# Altium schematic sheet 06_SAMA7G54-MPU.SchDoc
size 420 x 297 mm; SheetNumber: 27; SheetTotal: 29
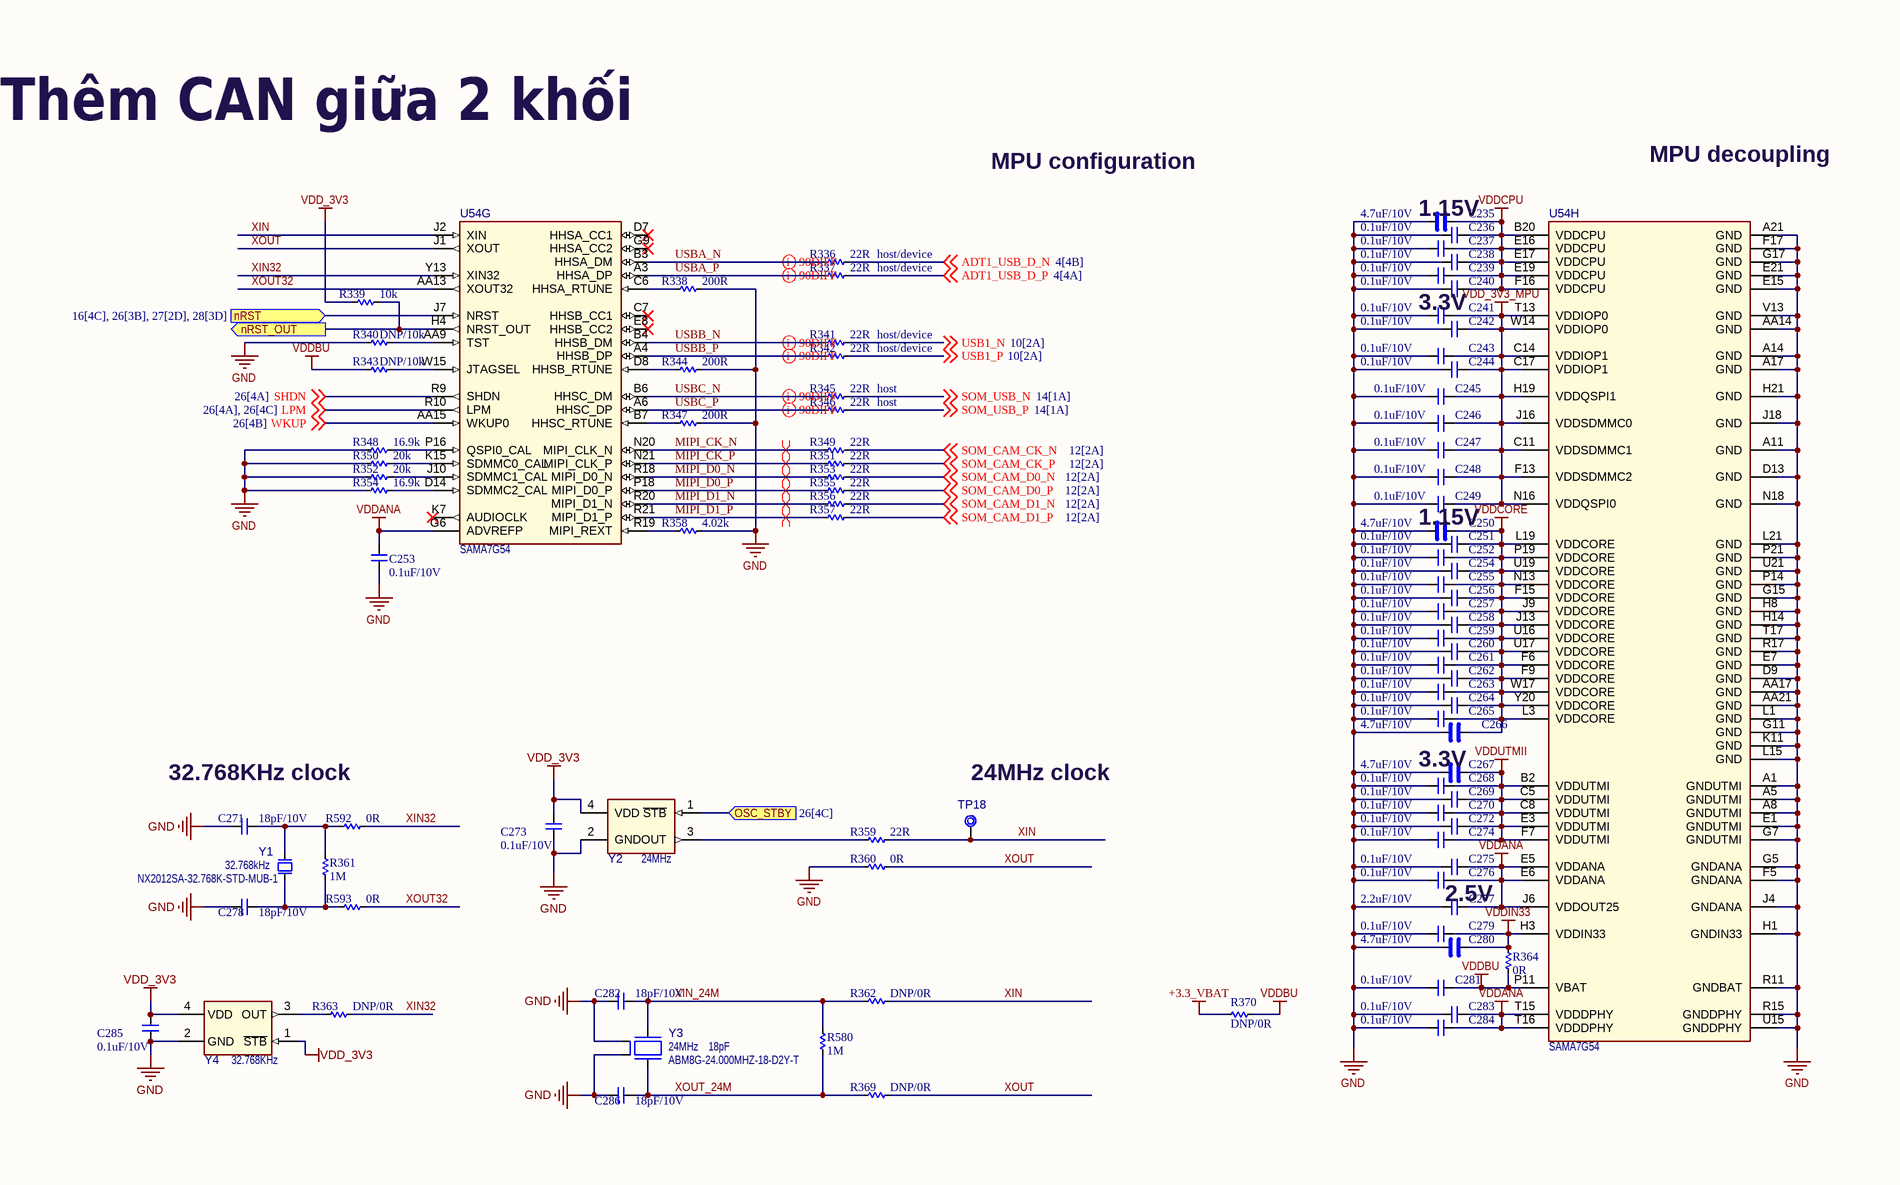
[diagram p0: 06_SAMA7G54-MPU.SchDoc, top left]
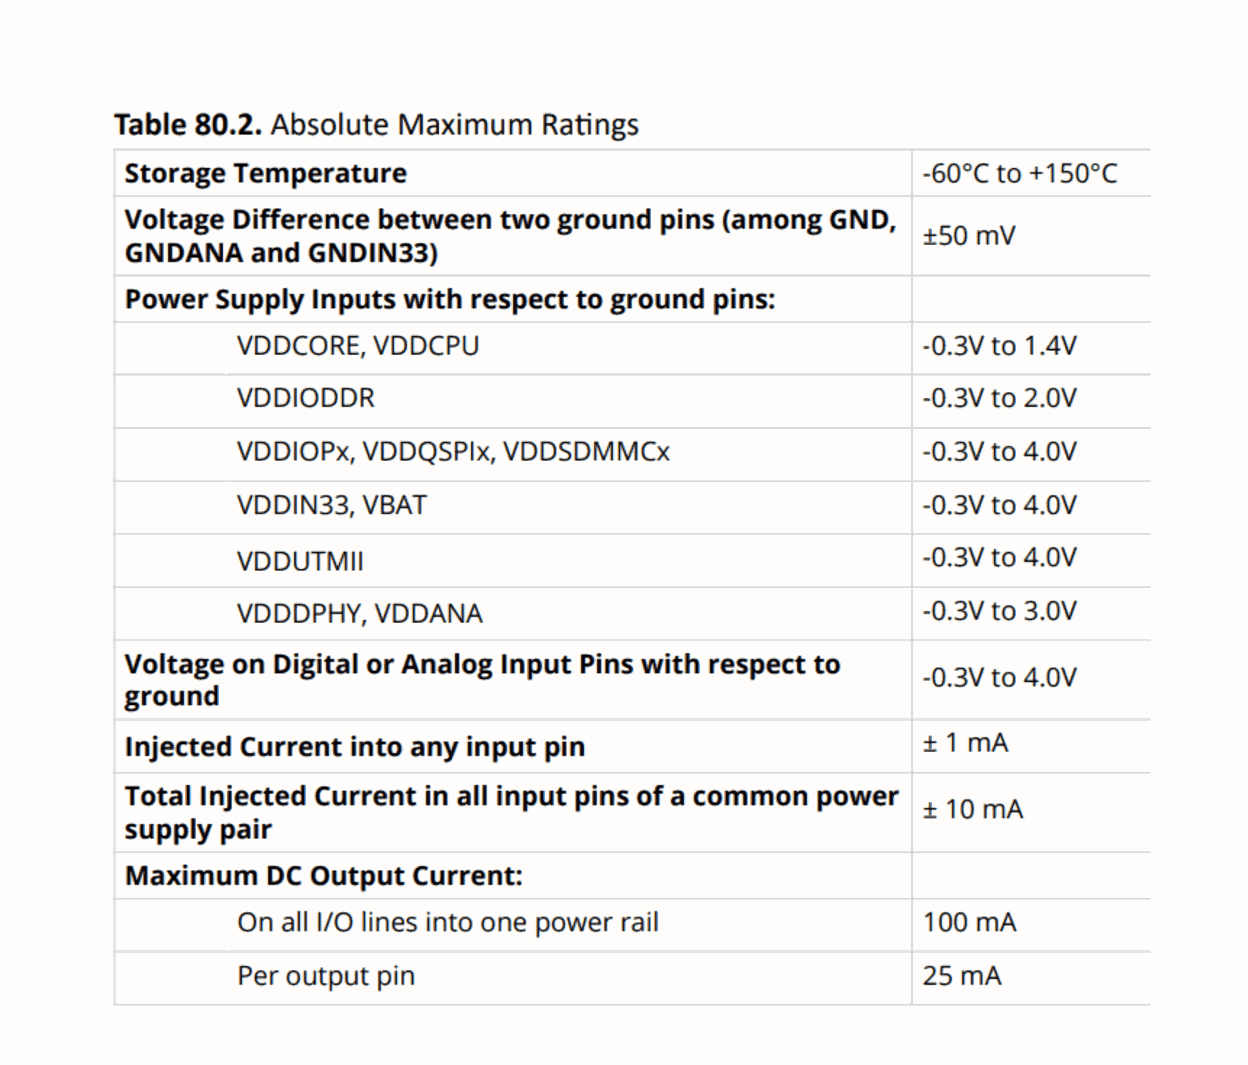
[diagram p1: 06_SAMA7G54-MPU.SchDoc, top right]
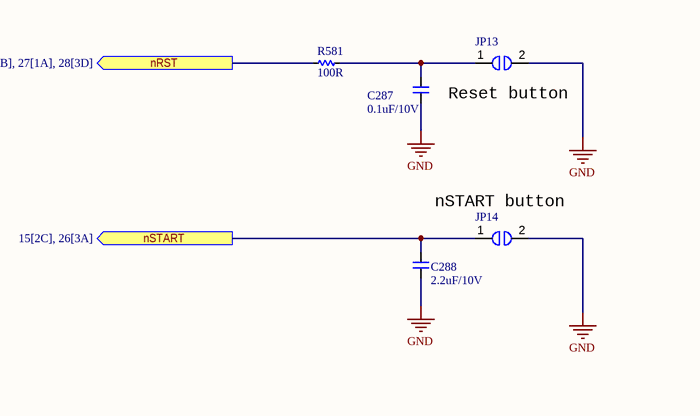
[diagram p2: 06_SAMA7G54-MPU.SchDoc, bottom left]
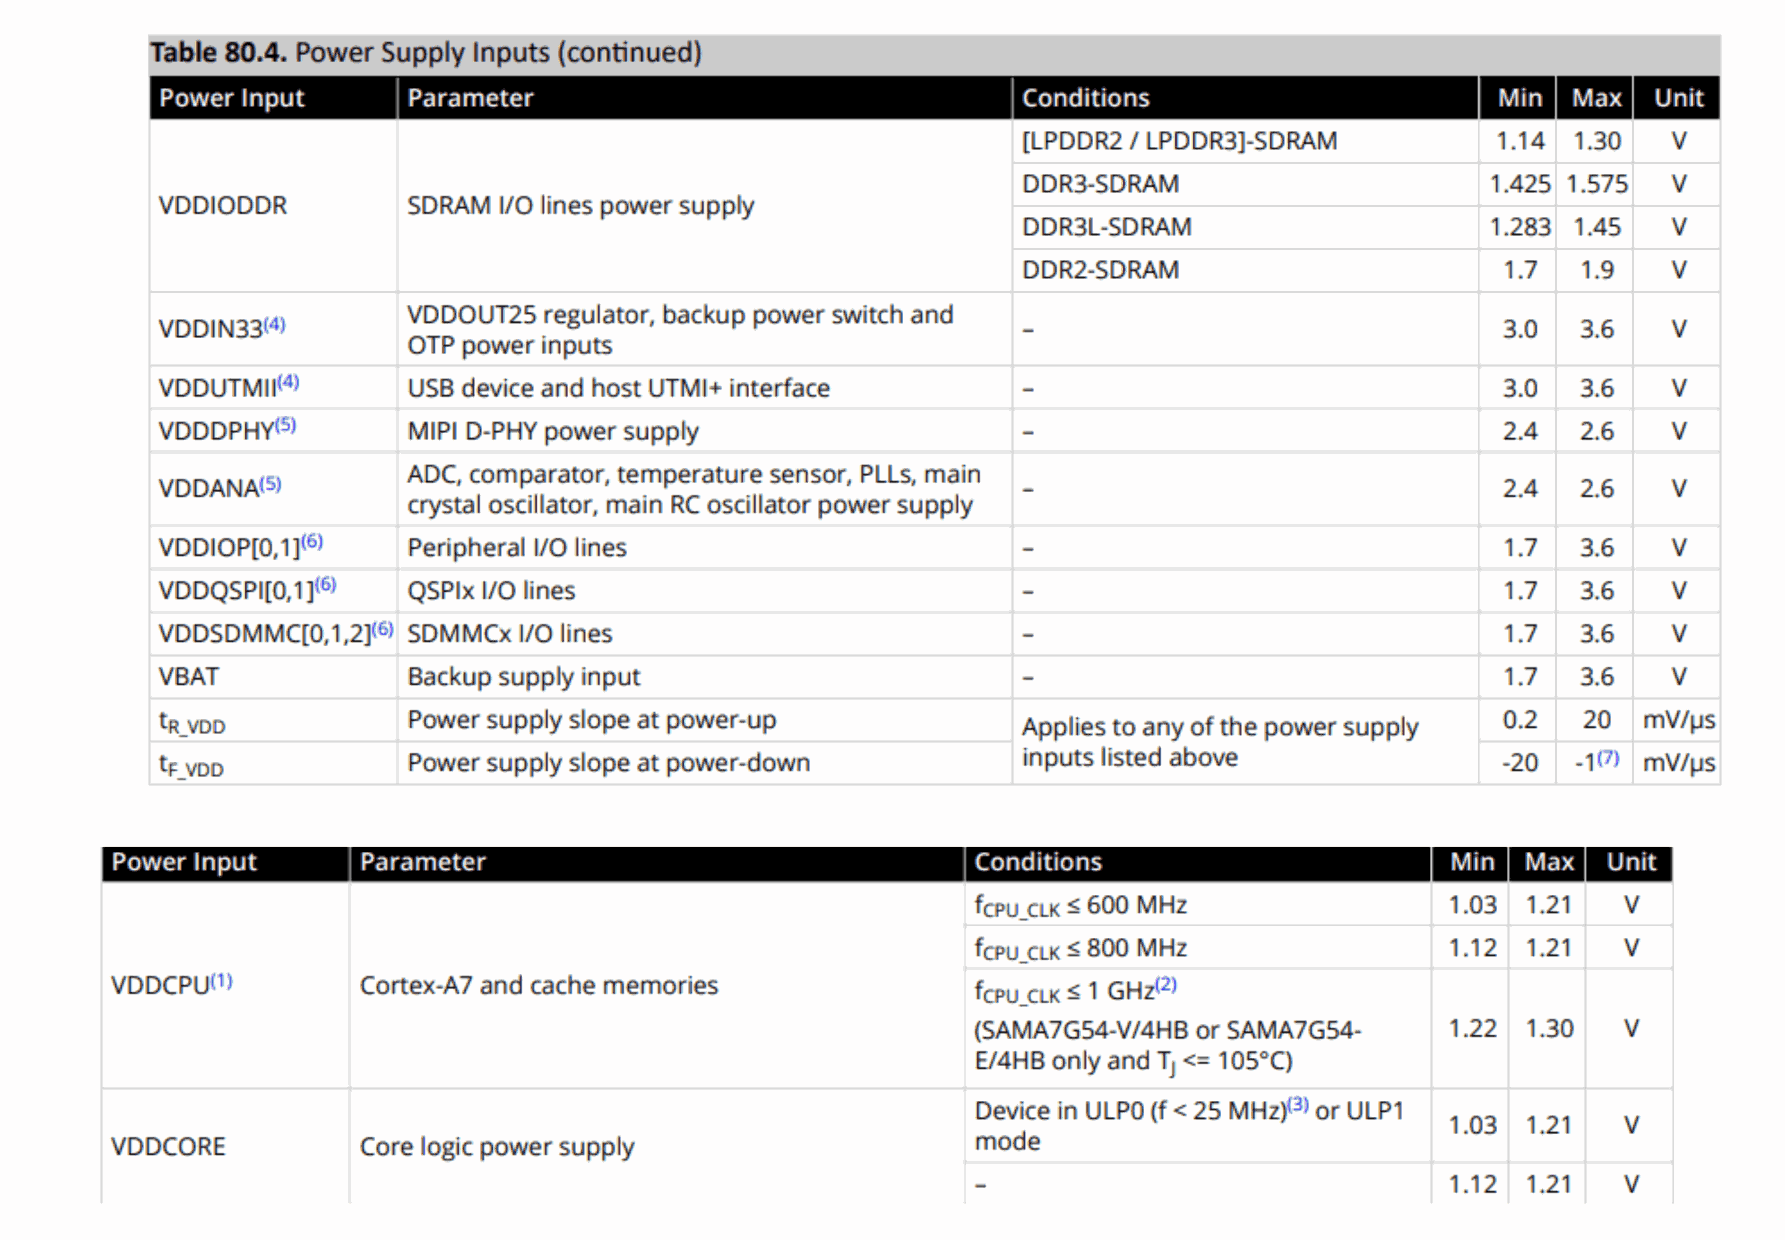
[diagram p3: 06_SAMA7G54-MPU.SchDoc, bottom right]

## Parts
C235  4.7uF/10V  [CAP_C_1005X60]
C236  0.1uF/10V  [CAP_C_0603x30]
C237  0.1uF/10V  [CAP_C_0603x30]
C238  0.1uF/10V  [CAP_C_0603x30]
C239  0.1uF/10V  [CAP_C_0603x30]
C240  0.1uF/10V  [CAP_C_0603x30]
C241  0.1uF/10V  [CAP_C_0603x30]
C242  0.1uF/10V  [CAP_C_0603x30]
C243  0.1uF/10V  [CAP_C_0603x30]
C244  0.1uF/10V  [CAP_C_0603x30]
C245  0.1uF/10V  [CAP_C_0603x30]
C246  0.1uF/10V  [CAP_C_0603x30]
C247  0.1uF/10V  [CAP_C_0603x30]
C248  0.1uF/10V  [CAP_C_0603x30]
C249  0.1uF/10V  [CAP_C_0603x30]
C250  4.7uF/10V  [CAP_C_1005X60]
C251  0.1uF/10V  [CAP_C_0603x30]
C252  0.1uF/10V  [CAP_C_0603x30]
C253  0.1uF/10V  [CAP_C_0603x30]
C254  0.1uF/10V  [CAP_C_0603x30]
C255  0.1uF/10V  [CAP_C_0603x30]
C256  0.1uF/10V  [CAP_C_0603x30]
C257  0.1uF/10V  [CAP_C_0603x30]
C258  0.1uF/10V  [CAP_C_0603x30]
C259  0.1uF/10V  [CAP_C_0603x30]
C260  0.1uF/10V  [CAP_C_0603x30]
C261  0.1uF/10V  [CAP_C_0603x30]
C262  0.1uF/10V  [CAP_C_0603x30]
C263  0.1uF/10V  [CAP_C_0603x30]
C264  0.1uF/10V  [CAP_C_0603x30]
C265  0.1uF/10V  [CAP_C_0603x30]
C266  4.7uF/10V  [CAP_C_1005X60]
C267  4.7uF/10V  [CAP_C_1005X60]
C268  0.1uF/10V  [CAP_C_0603x30]
C269  0.1uF/10V  [CAP_C_0603x30]
C270  0.1uF/10V  [CAP_C_0603x30]
C271  18pF/10V  [CAP_C_1005X60]
C272  0.1uF/10V  [CAP_C_0603x30]
C273  0.1uF/10V  [CAP_C_1005X60]
C274  0.1uF/10V  [CAP_C_0603x30]
C275  0.1uF/10V  [CAP_C_0603x30]
C276  0.1uF/10V  [CAP_C_0603x30]
C277  2.2uF/10V  [CAP_C_1005X50_L]
C278  18pF/10V  [CAP_C_1005X60]
C279  0.1uF/10V  [CAP_C_0603x30]
C280  4.7uF/10V  [CAP_C_1005X60]
C281  0.1uF/10V  [CAP_C_0603x30]
C282  18pF/10V  [CAP_C_1005X60]
C283  0.1uF/10V  [CAP_C_0603x30]
C284  0.1uF/10V  [CAP_C_0603x30]
C285  0.1uF/10V  [CAP_C_1005X60]
C286  18pF/10V  [CAP_C_1005X60]
C287  0.1uF/10V  [CAP_C_1005X60]
C288  2.2uF/10V  [CAP_C_1005X50_L]
JP13  (no value)  [TESTPOINT_SHORT_120X100_60]
JP14  (no value)  [TESTPOINT_SHORT_120X100_60]
R336  22R  [RES_C_0603X30]
R337  22R  [RES_C_0603X30]
R338  200R  [RES_C_0603X30]
R339  10k  [RES_C_1005X40]
R340  DNP/10k  [RES_C_1005X40]
R341  22R  [RES_C_0603X30]
R342  22R  [RES_C_0603X30]
R343  DNP/10k  [RES_C_1005X40]
R344  200R  [RES_C_0603X30]
R345  22R  [RES_C_0603X30]
R346  22R  [RES_C_0603X30]
R347  200R  [RES_C_0603X30]
R348  16.9k  [RES_C_0603X30]
R349  22R  [RES_C_0603X30]
R350  20k  [RES_C_0603X30]
R351  22R  [RES_C_0603X30]
R352  20k  [RES_C_0603X30]
R353  22R  [RES_C_0603X30]
R354  16.9k  [RES_C_0603X30]
R355  22R  [RES_C_0603X30]
R356  22R  [RES_C_0603X30]
R357  22R  [RES_C_0603X30]
R358  4.02k  [RES_C_0603X30]
R359  22R  [RES_C_1005X40]
R360  0R  [RES_C_1005X40]
R361  1M  [RES_C_1005X40]
R362  DNP/0R  [RES_C_1005X40]
R363  DNP/0R  [RES_C_1005X40]
R364  0R  [RES_C_1005X40]
R369  DNP/0R  [RES_C_1005X40]
R370  DNP/0R  [RES_C_1005X40]
R580  1M  [RES_C_1005X40]
R581  100R  [RES_C_1005X40]
R592  0R  [RES_C_1005X40]
R593  0R  [RES_C_1005X40]
TP18  Test Point No BOM  [Testpoint_80]  (value not drawn)  (no BOM)
U54  SAMA7G54  [TFBGA-343_14x14]  (parts G,H of 8)
Y1  value 32.768kHz  Manufacturer Part Number 1: NX2012SA-32.768K-STD-MUB-1  [CRYSTAL_NX2012SA]  (hidden comment: Crystal 2 Pins)
Y2  value 24MHz  [DFN-4_2.5x2]  (hidden comment: DSC10xx DFN-4)
Y3  value 24MHz  Load Capacitance: 18pF  Manufacturer Part Number 1: ABM8G-24.000MHZ-18-D2Y-T  [CRYSTAL_ABM8G]  (hidden comment: Crystal 4 Pins)
Y4  value 32.768KHz  [DFN-4_2x1.6]  (hidden comment: DSC60xx DFN-4_LGA-4)

## Ports
nRST (in, see 16[4C], 26[3B], 27[2D], 28[3D]), nRST (out, see 16[4C], 26[3B], 27[1A], 28[3D]), nRST_OUT (out), nSTART (out, see 15[2C], 26[3A]), OSC_STBY (in, see 26[4C])

## Nets
+3.3_VBAT: R370.1
GND: C235.2 C236.2 C237.2 C238.2 C239.2 C240.2 C241.2 C242.2 C243.2 C244.2 C245.2 C246.2 C247.2 C248.2 C249.2 C250.2 C251.2 C252.2 C253.1 C254.2 C255.2 C256.2 C257.2 C258.2 C259.2 C260.2 C261.2 C262.2 C263.2 C264.2 C265.2 C266.2 C267.2 C268.2 C269.2 C270.2 C271.2 C272.2 C273.1 C274.2 C275.2 C276.2 C277.2 C278.2 C279.2 C280.2 C281.2 C282.2 C283.2 C284.2 C285.1 C286.2 C287.1 C288.2 JP13.2 JP14.2 R338.1 R340.2 R344.1 R347.1 R348.2 R350.2 R352.2 R354.2 R358.1 R360.1 U54.A1(GNDUTMI) U54.A5(GNDUTMI) U54.A8(GNDUTMI) U54.A11(GND) U54.A14(GND) U54.A17(GND) U54.A21(GND) U54.AA14(GND) U54.AA17(GND) U54.AA21(GND) U54.D9(GND) U54.D13(GND) U54.E1(GNDUTMI) U54.E7(GND) U54.E15(GND) U54.E21(GND) U54.F5(GNDANA) U54.F17(GND) U54.G5(GNDANA) U54.G7(GNDUTMI) U54.G11(GND) U54.G15(GND) U54.G17(GND) U54.H1(GNDIN33) U54.H8(GND) U54.H14(GND) U54.H21(GND) U54.J4(GNDANA) U54.J18(GND) U54.K11(GND) U54.L1(GND) U54.L15(GND) U54.L21(GND) U54.N18(GND) U54.P14(GND) U54.P21(GND) U54.R11(GNDBAT) U54.R15(GNDDPHY) U54.R17(GND) U54.T17(GND) U54.U15(GNDDPHY) U54.U21(GND) U54.V13(GND) Y2.2(GND) Y3.2(GND) Y3.4(GND) Y4.2(GND)
VDD_3V3: C273.2 C285.2 R339.2 Y2.4(VDD) Y4.1(~{STB}) Y4.4(VDD)
VDD_3V3_MPU: C241.1 C242.1 C243.1 C244.1 C245.1 C246.1 C247.1 C248.1 C249.1 U54.C11(VDDSDMMC1) U54.C14(VDDIOP1) U54.C17(VDDIOP1) U54.F13(VDDSDMMC2) U54.H19(VDDQSPI1) U54.J16(VDDSDMMC0) U54.N16(VDDQSPI0) U54.T13(VDDIOP0) U54.W14(VDDIOP0)
VDDANA: C253.2 C275.1 C276.1 C277.1 C283.1 C284.1 U54.E5(VDDANA) U54.E6(VDDANA) U54.G6(ADVREFP) U54.J6(VDDOUT25) U54.T15(VDDDPHY) U54.T16(VDDDPHY)
VDDBU: C281.1 R343.2 R364.2 R370.2 U54.P11(VBAT)
VDDCORE: C250.1 C251.1 C252.1 C254.1 C255.1 C256.1 C257.1 C258.1 C259.1 C260.1 C261.1 C262.1 C263.1 C264.1 C265.1 C266.1 U54.F6(VDDCORE) U54.F9(VDDCORE) U54.F15(VDDCORE) U54.J9(VDDCORE) U54.J13(VDDCORE) U54.L3(VDDCORE) U54.L19(VDDCORE) U54.N13(VDDCORE) U54.P19(VDDCORE) U54.U16(VDDCORE) U54.U17(VDDCORE) U54.U19(VDDCORE) U54.W17(VDDCORE) U54.Y20(VDDCORE)
VDDCPU: C235.1 C236.1 C237.1 C238.1 C239.1 C240.1 U54.B20(VDDCPU) U54.E16(VDDCPU) U54.E17(VDDCPU) U54.E19(VDDCPU) U54.F16(VDDCPU)
VDDIN33: C279.1 C280.1 R364.1 U54.H3(VDDIN33)
VDDUTMII: C267.1 C268.1 C269.1 C270.1 C272.1 C274.1 U54.B2(VDDUTMI) U54.C5(VDDUTMI) U54.C8(VDDUTMI) U54.E3(VDDUTMI) U54.F7(VDDUTMI)
ADT1_USB_D_N: R336.1 ; off-sheet ADT1_USB_D_N
ADT1_USB_D_P: R337.1 ; off-sheet ADT1_USB_D_P
LPM: U54.R10(LPM) ; off-sheet LPM
MIPI_CK_N: R349.2 U54.N20(MIPI_CLK_N)
MIPI_CK_P: R351.2 U54.N21(MIPI_CLK_P)
MIPI_D0_N: R353.2 U54.R18(MIPI_D0_N)
MIPI_D0_P: R355.2 U54.P18(MIPI_D0_P)
MIPI_D1_N: R356.2 U54.R20(MIPI_D1_N)
MIPI_D1_P: R357.2 U54.R21(MIPI_D1_P)
nRST: R581.1 U54.J7(NRST) ; port nRST
nRST_OUT: R339.1 U54.H4(NRST_OUT) ; port nRST_OUT
nSTART: C288.1 JP14.1 ; port nSTART
OSC_STBY: Y2.1(~{STB}) ; port OSC_STBY
SHDN: U54.R9(SHDN) ; off-sheet SHDN
SOM_CAM_CK_N: R349.1 ; off-sheet SOM_CAM_CK_N
SOM_CAM_CK_P: R351.1 ; off-sheet SOM_CAM_CK_P
SOM_CAM_D0_N: R353.1 ; off-sheet SOM_CAM_D0_N
SOM_CAM_D0_P: R355.1 ; off-sheet SOM_CAM_D0_P
SOM_CAM_D1_N: R356.1 ; off-sheet SOM_CAM_D1_N
SOM_CAM_D1_P: R357.1 ; off-sheet SOM_CAM_D1_P
SOM_USB_N: R345.1 ; off-sheet SOM_USB_N
SOM_USB_P: R346.1 ; off-sheet SOM_USB_P
USB1_N: R341.1 ; off-sheet USB1_N
USB1_P: R342.1 ; off-sheet USB1_P
USBA_N: R336.2 U54.B3(HHSA_DM)
USBA_P: R337.2 U54.A3(HHSA_DP)
USBB_N: R341.2 U54.B4(HHSB_DM)
USBB_P: R342.2 U54.A4(HHSB_DP)
USBC_N: R345.2 U54.B6(HHSC_DM)
USBC_P: R346.2 U54.A6(HHSC_DP)
WKUP: U54.AA15(WKUP0) ; off-sheet WKUP
XIN: R359.2 R362.2 TP18.1 U54.J2(XIN)
XIN32: R363.2 R592.2 U54.Y13(XIN32)
XIN_24M: C282.1 R362.1 R580.1 Y3.3(Osc2)
XOUT: R360.2 R369.2 U54.J1(XOUT)
XOUT32: R593.2 U54.AA13(XOUT32)
XOUT_24M: C286.1 R369.1 R580.2 Y3.1(Osc1)
NetC271_1: C271.1 R361.1 R592.1 Y1.2(Osc2)
NetC278_1: C278.1 R361.2 R593.1 Y1.1(Osc1)
NetC287_2: C287.2 JP13.1 R581.2
NetR338_2: R338.2 U54.C6(HHSA_RTUNE)
NetR340_1: R340.1 U54.AA9(TST)
NetR343_1: R343.1 U54.W15(JTAGSEL)
NetR344_2: R344.2 U54.D8(HHSB_RTUNE)
NetR347_2: R347.2 U54.B7(HHSC_RTUNE)
NetR348_1: R348.1 U54.P16(QSPI0_CAL)
NetR350_1: R350.1 U54.K15(SDMMC0_CAL)
NetR352_1: R352.1 U54.J10(SDMMC1_CAL)
NetR354_1: R354.1 U54.D14(SDMMC2_CAL)
NetR358_2: R358.2 U54.R19(MIPI_REXT)
NetR359_1: R359.1 Y2.3(OUT)
NetR363_1: R363.1 Y4.3(OUT)

Not connected (* = marked no-connect by the designer): U54 C7(HHSB_CC1)* D7(HHSA_CC1)* E8(HHSB_CC2)* G9(HHSA_CC2)* K7(AUDIOCLK)*

## Layout directives
differential pair; differential pair class DIFF90; net class DIFF90: USBA_N, USBA_P, USBB_N, USBB_P, USBC_N, USBC_P
differential pair; net class DIFF100; differential pair class DIFF100: MIPI_CK_N, MIPI_CK_P, MIPI_D0_N, MIPI_D0_P, MIPI_D1_N, MIPI_D1_P

## Notes on the sheet
- Thêm CAN giữa 2 khối
- MPU configuration
- MPU decoupling
- (near C235) 1.15V
- host/device
- 3.3V
- host
- 1.15V
- 32.768KHz clock
- (near TP18) 24MHz clock
- (near C267) 3.3V
- (near C277) 2.5V
- Reset button
- (near JP14) nSTART button
- Project:
- Sub-system:
- Design by:
- Sheet title:
- Sheet
- of
- Checked by:
- Approved by:
- Revision:
- Document No:
- Size:
- Date:
- A3

## Library data of the parts
C235 C250 C266 C267 C280 = _CAP_C_High_2: CAP CHIP High Value
C236-C249 C251-C265 C268-C279 C281-C288 = _CAP_C_2: CAP CHIP
JP13 JP14 = JUMPER_1_1
R336-R364 R369 R370 R580 R581 R592 R593 = _RES_B_2: RES
TP18 = CON1759: Test Point; Value: TP PAD PCB 1mm; Description_: CON TP PAD PCB 1mm SMD; Dev Tools Status: Design; Owner: Cristian Papuc; Populated: YES; MCHP-ID: CON1759; Revision: A; Symbol: Test Point No BOM; Status: MCL Design; ComponentLink1Description: SVN Datasheet; ComponentLink2Description: Local Datasheet; ComponentLink3URL: C:\ALTIUM_WORK\00001_MCHP-CDB\Library\LibraryRefs\Test Point No BOM.SchLib; ComponentLink3Description: Open Symbol; ComponentLink4URL: C:\ALTIUM_WORK\00001_MCHP-CDB\Library\Footprints\TP_1mm_SMD.PcbLib; ComponentLink4Description: Open Footprint; ComponentLink5Description: Open Footprint 2; ComponentLink6Description: Open Footprint 3; ComponentLink7Description: Open Footprint 4; Type: Test Point; Category: Connector; Quantity Override: 1
U54 = MIC8923: SAMA7G54 MPU 1000MHz Cortex-A7 TFBGA-343; Manufacturer Part Number 1: SAMA7G54-V/4HB; Manufacturer 1: Microchip; Description_: MCHP MPU 32-BIT Cortex-A7 1000MHz 128kB SAMA7G54-V/4HB TFBGA-343; Populated: YES; Dev Tools Status: Design; Owner: Ciprian Abramov; Package: TFBGA-343; MCHP-ID: MIC8923; Value: SAMA7G54; Symbol: SAMA7G54 TFBGA-343; Type: 32-Bit MPU; Status: MCL Design; Revision: 1; Category: MCHP-Microcontroller; ComponentLink1Description: SVN Datasheet; ComponentLink2Description: Local Datasheet; ComponentLink3URL: C:\ALTIUM_WORK\00001_MCHP-CDB\Library\LibraryRefs\SAMA7G54 TFBGA-343.SchLib; ComponentLink3Description: Open Symbol; ComponentLink4URL: C:\ALTIUM_WORK\00001_MCHP-CDB\Library\Footprints\TFBGA-343_14x14.PcbLib; ComponentLink4Description: Open Footprint; ComponentLink5Description: Open Footprint 2; ComponentLink6Description: Open Footprint 3; ComponentLink7Description: Open Footprint 4; Supplier 1: Microchip; Supplier Part Number 1: SAMA7G54-V/4HB; Quantity Override: 1
Y1 = OSC1092: Crystal; Manufacturer 1: NDK; Description_: CRYSTAL 32.768kHz 12.5pF SMD NX2012SA; Dev Tools Status: Production; Owner: Jamus Griego; Tolerance: ±20ppm; Load Capacitance: 12.5pF; Populated: YES; MCHP-ID: OSC1092; Revision: 1; Symbol: Crystal 2 Pins; Status: MCL Design; ComponentLink1URL: https://chn-vm-apps.microchip.com/mchprepo/parts/Datasheets/c_NX2012SA-STD-MUB-1_e.pdf; ComponentLink1Description: SVN Datasheet; ComponentLink2URL: C:\ALTIUM_WORK\00001_MCHP-CDB\Datasheets\c_NX2012SA-STD-MUB-1_e.pdf; ComponentLink2Description: Local Datasheet; ComponentLink3URL: C:\ALTIUM_WORK\00001_MCHP-CDB\Library\LibraryRefs\Crystal 2 Pins.SchLib; ComponentLink3Description: Open Symbol; ComponentLink4URL: C:\ALTIUM_WORK\00001_MCHP-CDB\Library\Footprints\CRYSTAL_NX2012SA.PcbLib; ComponentLink4Description: Open Footprint; ComponentLink5Description: Open Footprint 2; ComponentLink6Description: Open Footprint 3; ComponentLink7Description: Open Footprint 4; Type: Crystal; Category: Crystal/Oscillator; Supplier 1: Digi-Key; Supplier Part Number 1: 644-1219-1-ND; Quantity Override: 1
Y2 = MIC6659: Manufacturer 1: Microchip Technology; Manufacturer Part Number 1: DSC1001DI5-024.0000T; Description_: MCHP CLOCK OSCILLATOR SINGLE 24MHz DSC1001DI5-024.0000 SMD-2520; Dev Tools Status: Design; Owner: Maurizio Gavardoni; Populated: YES; MCHP-ID: MIC6659; Revision: A; Symbol: DSC10xx DFN-4; Status: MCL Design; ComponentLink1Description: SVN Datasheet; ComponentLink2Description: Local Datasheet; ComponentLink3URL: C:\ALTIUM_WORK\00001_MCHP-CDB\Library\LibraryRefs\DSC10xx DFN-4.SchLib; ComponentLink3Description: Open Symbol; ComponentLink4URL: C:\ALTIUM_WORK\00001_MCHP-CDB\Library\Footprints\DFN-4_2.5x2.PcbLib; ComponentLink4Description: Open Footprint; ComponentLink5Description: Open Footprint 2; ComponentLink6Description: Open Footprint 3; ComponentLink7Description: Open Footprint 4; Category: MCHP-Clock/Timing; Type: Oscillator; Supplier 1: Digi-Key; Supplier Part Number 1: DSC1001DI5-024.0000T-ND; Quantity Override: 1
Y3 = OSC1047: Crystal; Manufacturer 1: Abracon Corporation; Description_: CRYSTAL 24MHz 18pF SMD ABM8G; Dev Tools Status: Production; Owner: Mark Loper; Populated: DNP; MCHP-ID: OSC1047; Revision: 1; Symbol: Crystal 4 Pins; Status: MCL Design; ComponentLink1URL: https://chn-vm-apps.microchip.com/mchprepo/parts/Datasheets/ABM8G.pdf; ComponentLink1Description: SVN Datasheet; ComponentLink2URL: C:\ALTIUM_WORK\00001_MCHP-CDB\Datasheets\ABM8G.pdf; ComponentLink2Description: Local Datasheet; ComponentLink3URL: C:\ALTIUM_WORK\00001_MCHP-CDB\Library\LibraryRefs\Crystal 4 Pins.SchLib; ComponentLink3Description: Open Symbol; ComponentLink4URL: C:\ALTIUM_WORK\00001_MCHP-CDB\Library\Footprints\CRYSTAL_ABM8G.PcbLib; ComponentLink4Description: Open Footprint; ComponentLink5Description: Open Footprint 2; ComponentLink6Description: Open Footprint 3; ComponentLink7Description: Open Footprint 4; Package: ABM8G; Type: Crystal; Category: Crystal/Oscillator; Supplier 1: Digi-Key; Supplier Part Number 1: 535-10273-1-ND; Quantity Override: 1
Y4 = MIC8888: Manufacturer 1: Microchip Technology; Manufacturer Part Number 1: DSC6003MA3B-032K768; Description_: MCHP CLOCK OSCILLATOR SINGLE 32.768KHz DSC6003MA3B-032K768 SMD DFN-4; Dev Tools Status: Design; Owner: Ciprian Abramov; Populated: DNP; MCHP-ID: MIC8888; Revision: 1; Symbol: DSC60xx DFN-4_LGA-4; Status: MCL Design; ComponentLink1Description: SVN Datasheet; ComponentLink2Description: Local Datasheet; ComponentLink3URL: C:\ALTIUM_WORK\00001_MCHP-CDB\Library\LibraryRefs\DSC60xx DFN-4_LGA-4.SchLib; ComponentLink3Description: Open Symbol; ComponentLink4URL: C:\ALTIUM_WORK\00001_MCHP-CDB\Library\Footprints\DFN-4_2x1.6.PcbLib; ComponentLink4Description: Open Footprint; ComponentLink5Description: Open Footprint 2; ComponentLink6Description: Open Footprint 3; ComponentLink7Description: Open Footprint 4; Category: MCHP-Clock/Timing; Type: Oscillator; Supplier 1: Digi-Key; Supplier Part Number 1: DSC6003MA3B-032K768-ND; Quantity Override: 1; Supplier 2: Mouser; Supplier Part Number 2: 579-6003MA3B032K768